# EAGLE design 609_gecko (EAGLE 9.6.2)
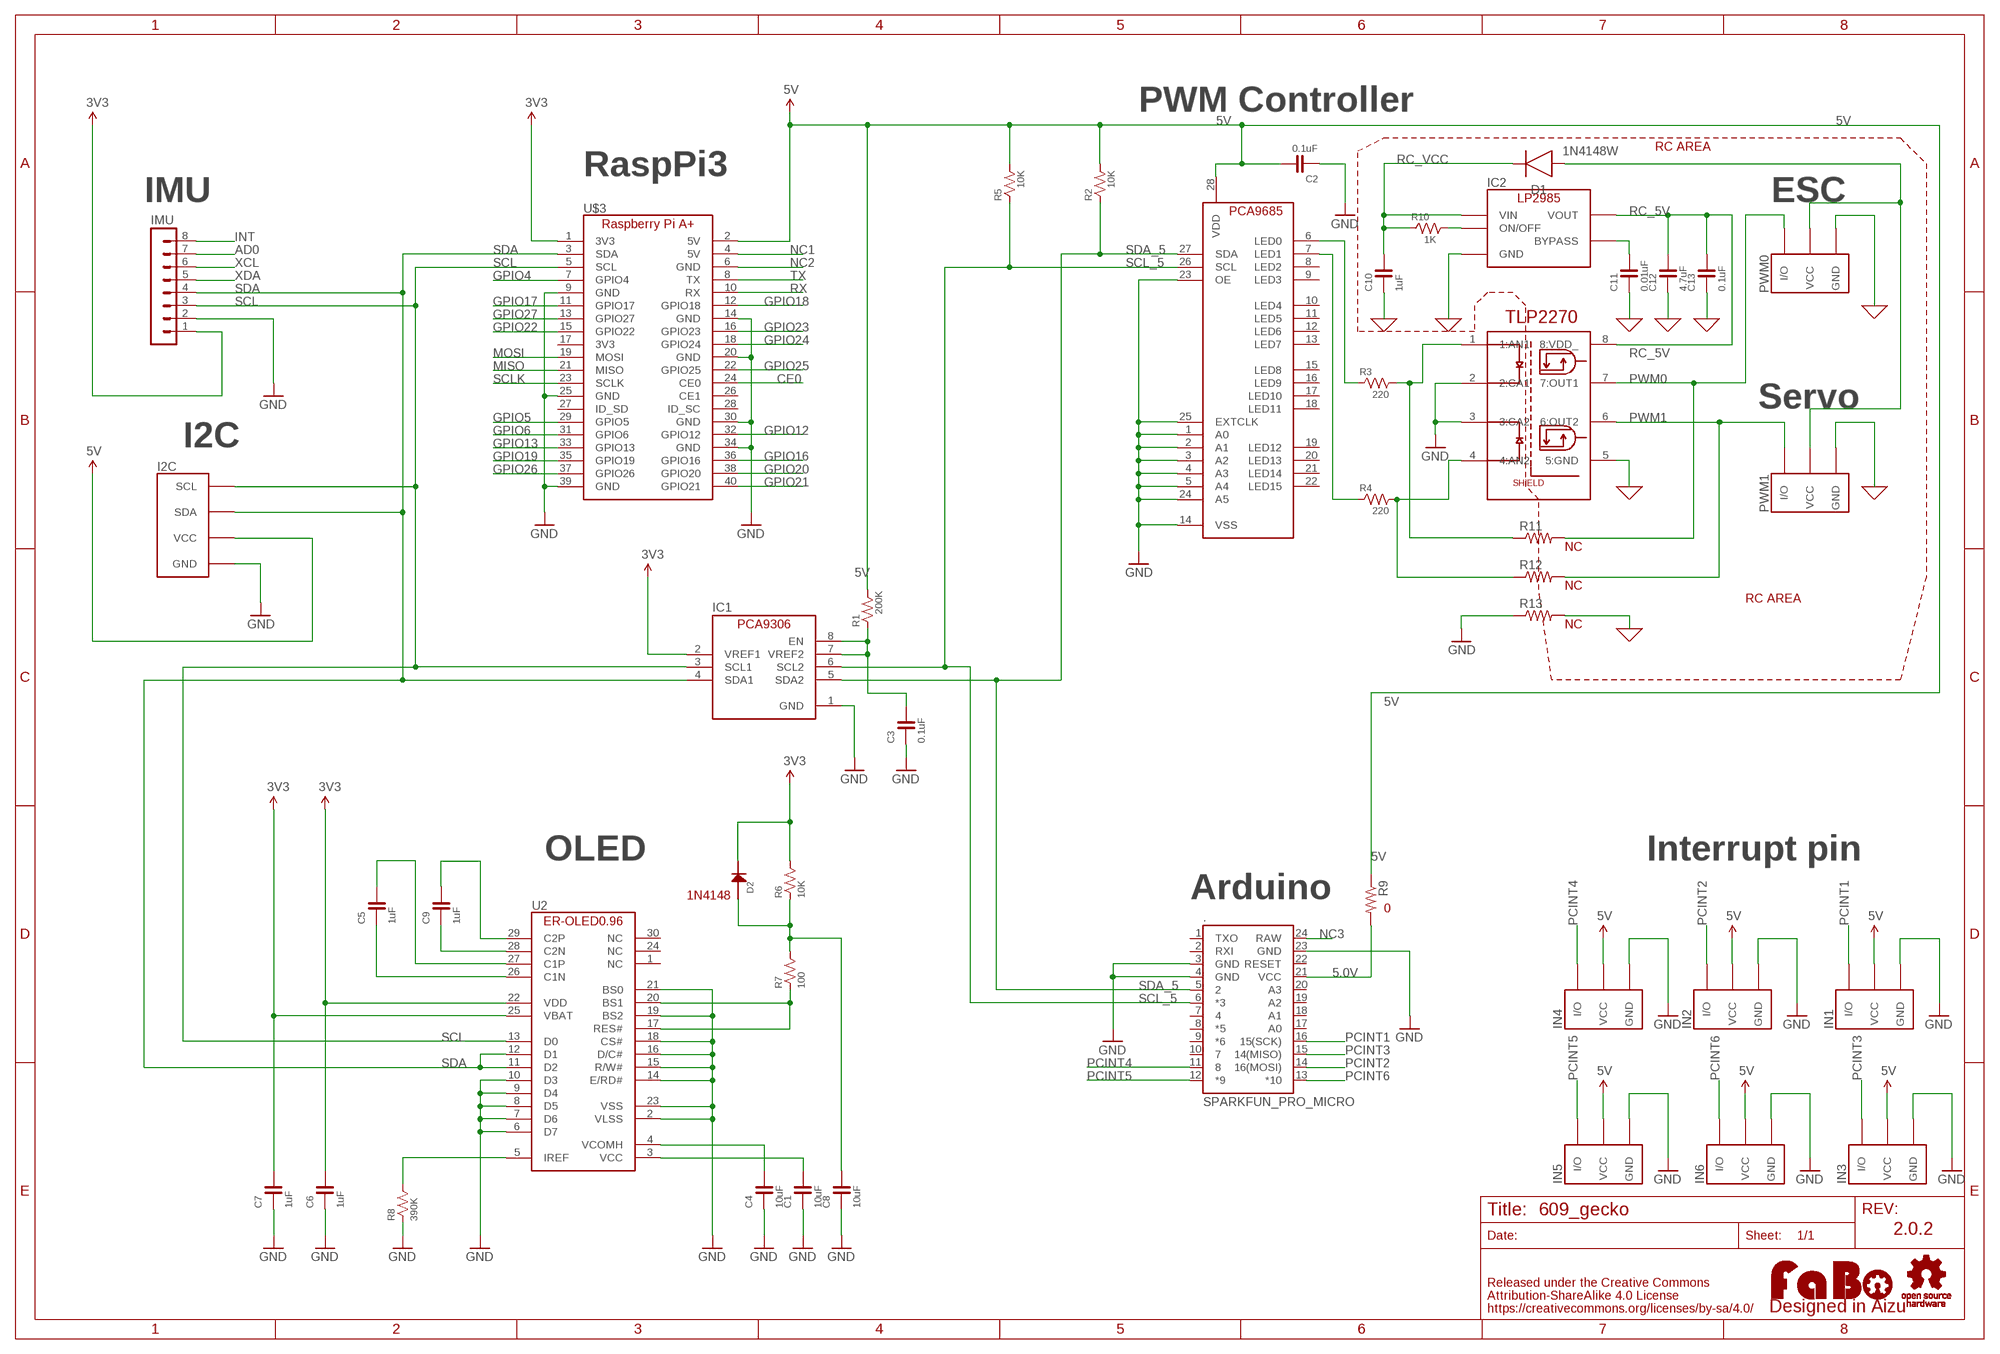
[diagram p0: schematic, sheet 1]

## Parts
.  SPARKFUN_PRO_MICRO  [SPARKFUN_PRO_MICRO]
C1  10uF  CAPACITOR-0603  [0603]
C2  0.1uF  CAPACITOR-0603  [0603]
C3  0.1uF  CAPACITOR-0603  [0603]
C4  10uF  CAPACITOR-0603  [0603]
C5  1uF  CAPACITOR-0603  [0603]
C6  1uF  CAPACITOR-0603  [0603]
C7  1uF  CAPACITOR-0603  [0603]
C8  10uF  CAPACITOR-0603  [0603]
C9  1uF  CAPACITOR-0603  [0603]
C10  1uF  CAPACITOR-0603  [0603]
C11  0.01uF  CAPACITOR-0603  [0603]
C12  4.7uF  CAPACITOR-0603  [0603]
C13  0.1uF  CAPACITOR-0603  [0603]
D1  1N4148W  DIODE_1N4148W-7-F_SOD123G  [SOD3715X135]
D2  1N4148  [1N4148W]
I2C  FABO_BRICK_I2C-B04B-PASK-1_SILK  [FABO_BRICK_I2C_B04B-PASK-1_SILK]
IC1  PCA9306_SSOP  [8PIN-SSOP]
IC2  LP2985-33DBV  [SOT-23-5]
IMU  MA08-1  [MA08-1]
IN1  FABO_BRICK_3PIN-HEADER  [FABO_BRICK_3PIN_HEADER]
IN2  FABO_BRICK_3PIN-HEADER  [FABO_BRICK_3PIN_HEADER]
IN3  FABO_BRICK_3PIN-HEADER  [FABO_BRICK_3PIN_HEADER]
IN4  FABO_BRICK_3PIN-HEADER  [FABO_BRICK_3PIN_HEADER]
IN5  FABO_BRICK_3PIN-HEADER  [FABO_BRICK_3PIN_HEADER]
IN6  FABO_BRICK_3PIN-HEADER  [FABO_BRICK_3PIN_HEADER]
LOGO1  LOGO_FABO-M  [LOGO_FABO_M]
PWM0  FABO_BRICK_3PIN-HEADER  [FABO_BRICK_3PIN_HEADER]
PWM1  FABO_BRICK_3PIN-HEADER  [FABO_BRICK_3PIN_HEADER]
R1  200K  RESISTOR-0603  [0603]
R2  10K  RESISTOR-0603  [0603]
R3  220  RESISTOR-0603  [0603]
R4  220  RESISTOR-0603  [0603]
R5  10K  RESISTOR-0603  [0603]
R6  10K  RESISTOR-0603  [0603]
R7  100  RESISTOR-0603  [0603]
R8  390K  RESISTOR-0603  [0603]
R9  CRCW08050000Z0EA  [RES_0805]
R10  1K  RESISTOR-0603  [0603]
R11  CRCW08050000Z0EA  [RES_0805]
R12  CRCW08050000Z0EA  [RES_0805]
R13  CRCW08050000Z0EA  [RES_0805]
U2  ER-OLED0.96-1ER-CON30HT-1  [ER-CON30HT-1]
U$3  RASPBERRY_PI_A+  [RASPBERRY_PI_A+]
U$9  PCA9685  [PCA9685]
U$10  TLP2270  [TLP2270]
U$12  LOGO_OSHW-M_BOTTOM  [LOGO_OSHW_M_BOTTOM]

## Nets
0: C10.1 C11.1 C12.1 C13.1 IC2.2(GND) PWM0.GND PWM1.GND R13.2 U$10.5(5:GND) ; supply symbol labelled GND
3V3: C6.2 C7.2 D2.CATHODE IC1.2(VREF1) IMU.1 R6.2 U2.22(VDD) U2.25(VBAT) U$3.1(3V3)
5.0V: ..21(VCC) R9.2
5V: C2.2 I2C.VCC IN1.VCC IN2.VCC IN3.VCC IN4.VCC IN5.VCC IN6.VCC R1.2 R2.2 R5.2 R9.1 U$3.2(5V) U$9.28(VDD)
AD0: IMU.7
CE0: U$3.24(CE0)
GND: ..3(GND) ..4(GND) ..23(GND) C1.1 C2.1 C3.1 C4.1 C6.1 C7.1 C8.1 I2C.GND IC1.1(GND) IMU.2 IN1.GND IN2.GND IN3.GND IN4.GND IN5.GND IN6.GND R8.1 R13.1 U2.2(VLSS) U2.6(D7) U2.7(D6) U2.8(D5) U2.9(D4) U2.10(D3) U2.14(E/RD#) U2.15(R/W#) U2.16(D/C#) U2.18(CS#) U2.19(BS2) U2.21(BS0) U2.23(VSS) U$3.9(GND) U$3.14(GND) U$3.20(GND) U$3.25(GND) U$3.30(GND) U$3.34(GND) U$3.39(GND) U$9.1(A0) U$9.2(A1) U$9.3(A2) U$9.4(A3) U$9.5(A4) U$9.14(VSS) U$9.23(OE) U$9.24(A5) U$9.25(EXTCLK) U$10.2(2:CA1) U$10.3(3:CA2)
GPIO4: U$3.7(GPIO4)
GPIO5: U$3.29(GPIO5)
GPIO6: U$3.31(GPIO6)
GPIO12: U$3.32(GPIO12)
GPIO13: U$3.33(GPIO13)
GPIO16: U$3.36(GPIO16)
GPIO17: U$3.11(GPIO17)
GPIO18: U$3.12(GPIO18)
GPIO19: U$3.35(GPIO19)
GPIO20: U$3.38(GPIO20)
GPIO21: U$3.40(GPIO21)
GPIO22: U$3.15(GPIO22)
GPIO23: U$3.16(GPIO23)
GPIO24: U$3.18(GPIO24)
GPIO25: U$3.22(GPIO25)
GPIO26: U$3.37(GPIO26)
GPIO27: U$3.13(GPIO27)
INT: IMU.8
MISO: U$3.21(MISO)
MOSI: U$3.19(MOSI)
N$2: R3.1 U$9.6(LED0)
N$3: C5.2 U2.27(C1P)
N$4: R4.1 U$9.7(LED1)
N$5: C3.2 IC1.7(VREF2) IC1.8(EN) R1.1
N$6: D1.2(A) PWM0.VCC PWM1.VCC
N$7: R3.2 R11.1 U$10.1(1:AN1)
N$8: R4.2 R12.1 U$10.4(4:AN2)
N$13: IC2.3(ON/OFF) R10.2
N$14: C11.2 IC2.4(BYPASS)
N$19: C5.1 U2.26(C1N)
N$21: C9.1 U2.28(C2N)
N$22: C9.2 U2.29(C2P)
N$30: R8.2 U2.5(IREF)
N$31: C4.2 U2.4(VCOMH)
N$33: C1.2 U2.3(VCC)
N$34: R7.1 U2.17(RES#) U2.20(BS1)
N$35: C8.2 D2.ANODE R6.1 R7.2
NC1: U$3.4(5V)
NC2: U$3.6(GND)
NC3: ..24(RAW)
PCINT1: ..16(15(SCK)) IN1.I/O
PCINT2: ..14(16(MOSI)) IN2.I/O
PCINT3: ..15(14(MISO)) IN3.I/O
PCINT4: ..11 IN4.I/O
PCINT5: ..12(*9) IN5.I/O
PCINT6: ..13(*10) IN6.I/O
PWM0: PWM0.I/O R11.2 U$10.7(7:OUT1)
PWM1: PWM1.I/O R12.2 U$10.6(6:OUT2)
RC_5V: C12.2 C13.2 IC2.5(VOUT) U$10.8(8:VDD_)
RC_VCC: C10.2 D1.1(C) IC2.1(VIN) R10.1
RX: U$3.10(RX)
SCL: I2C.SCL IC1.3(SCL1) IMU.3 U2.13(D0) U$3.5(SCL)
SCL_5: ..6(*3) IC1.6(SCL2) R5.1 U$9.26(SCL)
SCLK: U$3.23(SCLK)
SDA: I2C.SDA IC1.4(SDA1) IMU.4 U2.11(D2) U2.12(D1) U$3.3(SDA)
SDA_5: ..5 IC1.5(SDA2) R2.1 U$9.27(SDA)
TX: U$3.8(TX)
XCL: IMU.6
XDA: IMU.5
Unconnected: ..1(TXO) ..2(RXI) ..7 ..8(*5) ..9(*6) ..10 ..17(A0) ..18(A1) ..19(A2) ..20(A3) ..22(RESET) U2.1(NC) U2.24(NC) U2.30(NC) U$3.17(3V3) U$3.26(CE1) U$3.27(ID_SD) U$3.28(ID_SC) U$9.8(LED2) U$9.9(LED3) U$9.10(LED4) U$9.11(LED5) U$9.12(LED6) U$9.13(LED7) U$9.15(LED8) U$9.16(LED9) U$9.17(LED10) U$9.18(LED11) U$9.19(LED12) U$9.20(LED13) U$9.21(LED14) U$9.22(LED15)

## Notes on the sheet
- PWM Controller
- RC AREA
- RaspPi3
- IMU | ESC
- Servo
- I2C
- NC
- NC
- RC AREA
- NC
- Interrupt pin
- OLED
- 1N4148 | Arduino
- 0
- 2.0.2

## Library data of the parts
. = SparkFun-Boards:SPARKFUN_PRO_MICRO: SparkFun Pro Micro Atmega32U4 compatible footprint. SparkFun Products: 3.3V/8MHz <https://www.sparkfun.com/products/12587> 5V/16MHz <https://www.sparkfun.com/products/12640>
C1 C2 C4-C9 = FaBo-Capacitor:CAPACITOR: CAPACITOR
C3 C10-C13 = FaBo-Capacitor:CAPACITOR: CAPACITOR; SPICEPREFIX: C
D1 = Diode:DIODE_: Diode Rectifier - Popular parts; CATEGORY: Diode; DESCRIPTION: DIODE GEN PURP 100V 300MA SOD123; MANUFACTURER: Diodes Incorporated; SUB-CATEGORY: Rectifier
D2 = FaBo-Diode:1N4148
I2C = FaBo-Template:FABO_BRICK_I2C: FaBo Brick I2C
IC1 = FaBo-LevelTranslator:PCA9306
IC2 = FaBo-Supply:LP2985: LP2985
IMU = con-lstb:MA08-1: PIN HEADER; OC_FARNELL: unknown; OC_NEWARK: unknown
IN1-IN6 PWM0 PWM1 = FaBo-Template:FABO_BRICK_3PIN: FaBo Brick 3pin
LOGO1 = component:LOGO_FABO
R1-R8 R10 = FaBo-Resistors:RESISTOR: RESISTOR
R9 R11-R13 = Resistor_Capacitor:CRCW08050000Z0EA: RES SMD 0 OHM JUMPER 1/8W 0805 Manufacturer's datasheet <http://www.vishay.com/docs/20035/dcrcwe3.pdf>; CREATED_BY: PCBLayout.com; DIGIKEY_PART_NUMBER: 541-0.0ATR-ND; MANUFACTURER: Vishay Dale; MPN: CRCW08050000Z0EA; PACKAGE: SMD 0805
U2 = FaBo-Display:ER-OLED0.96-1
U$3 = FaBo-Boards:RASPBERRY_PI_A+
U$9 = FaBo-Motor:PCA9685
U$10 = FaBo_Photocoupler:TLP2270
U$12 = component:LOGO_OSHW

## Board
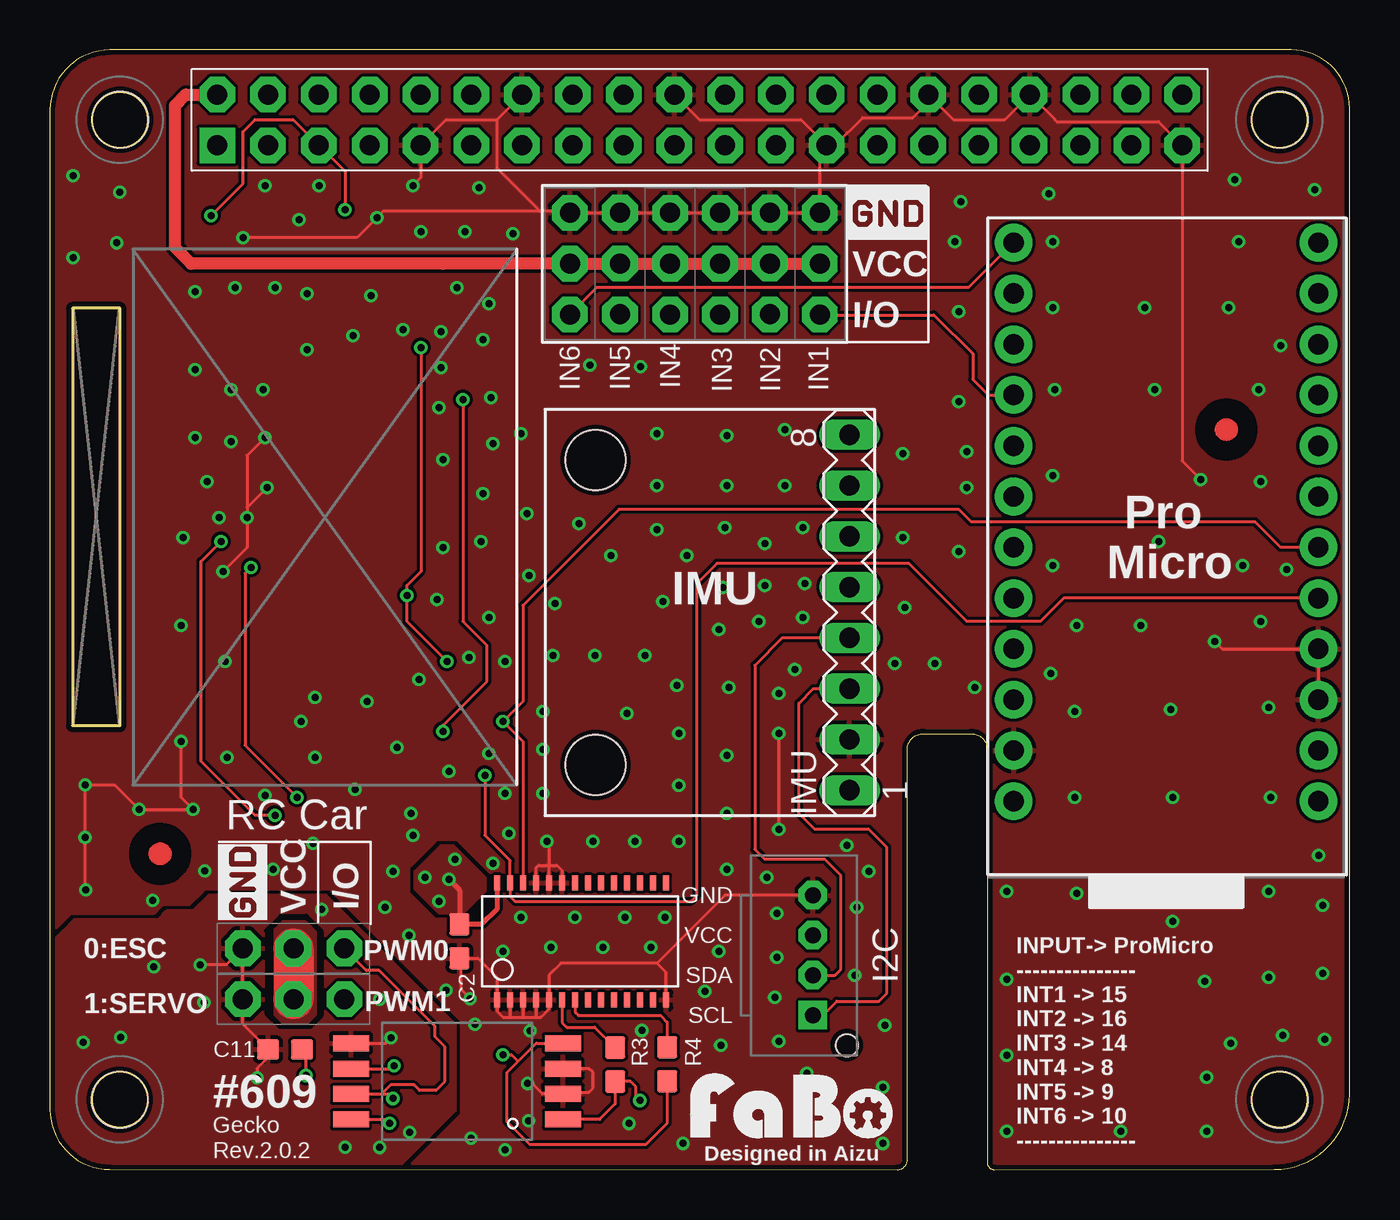
[diagram p1: board, top side]
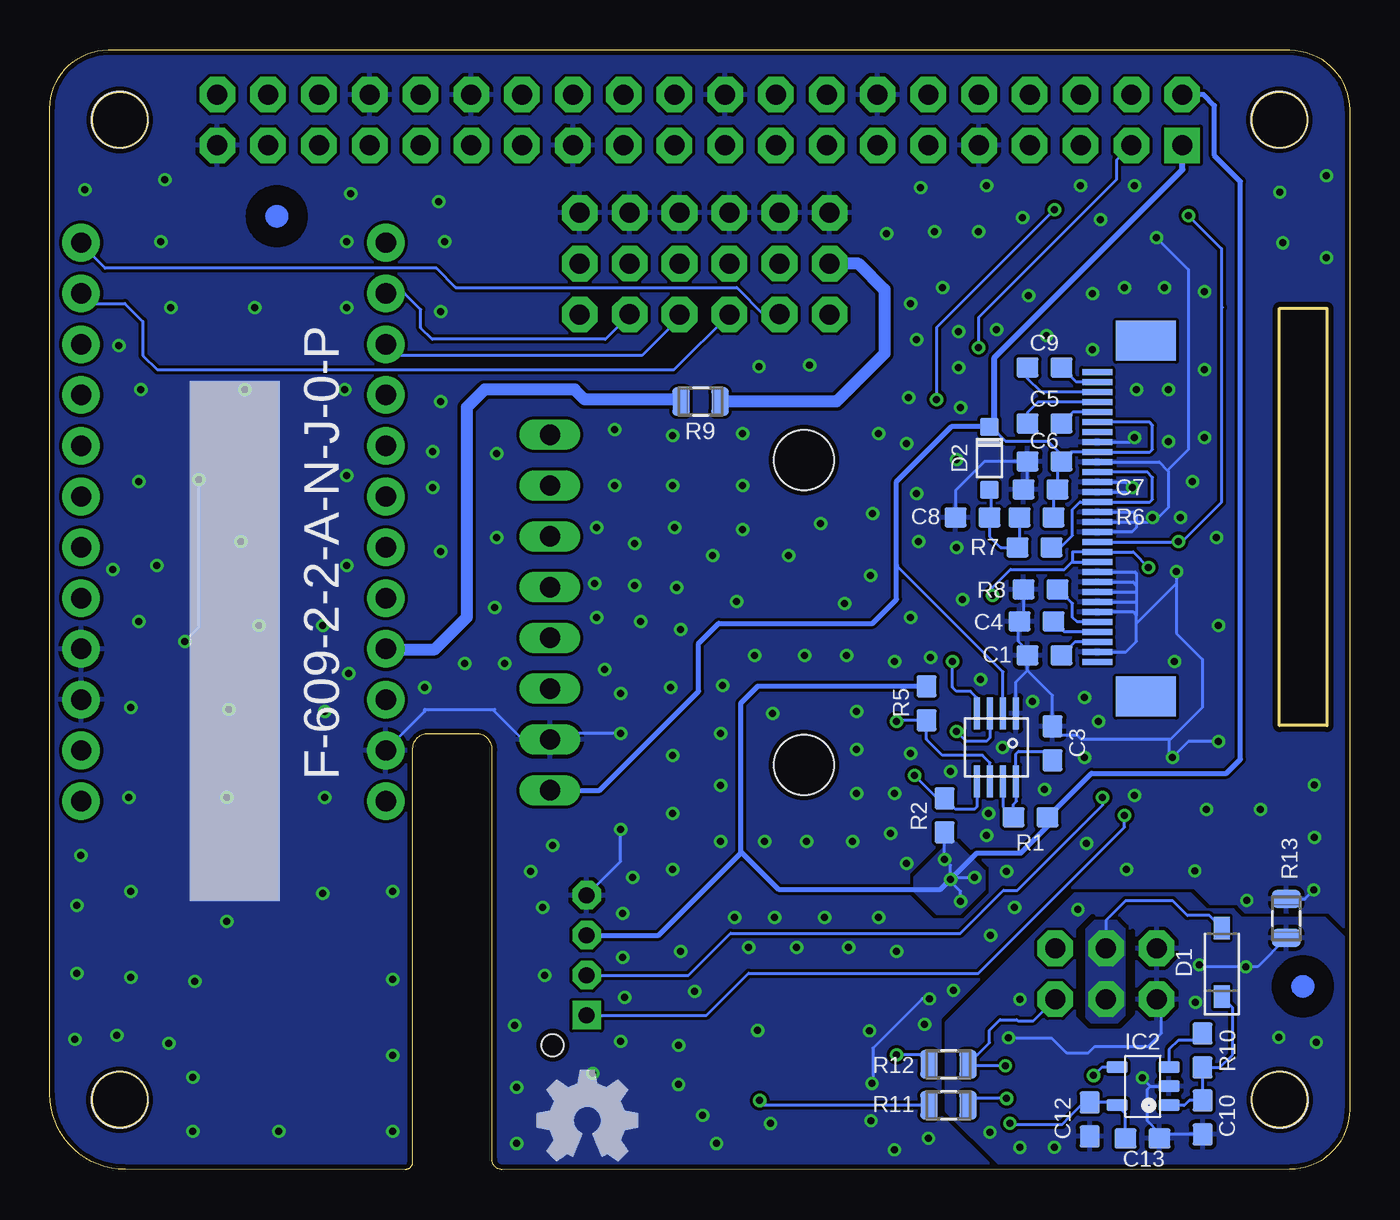
[diagram p2: board, bottom side, seen from below]

Size 65 x 56 mm. Coordinates in mm from the lower left corner, seen from the top.
Outline: 3.5,22.21 3.5,43.09 1.13,43.09 1.13,22.21 3.5,22.21
Copper layers (1*16): Top 0.035mm / dielectric 1.6mm / Bottom 0.035mm
Design rules "PCBway": minimum track width 6mil, minimum drill 12mil, track to track 6mil, track to pad 6mil, pad to pad 6mil, via to via 6mil, smd to smd 6mil, copper to edge 10mil, drill to drill 10mil, minimum pad ring 10mil, minimum via ring 6mil, stop-mask expansion 2mil, vias tented up to drill 100mil, thermal gap 8mil
Holes 2.8 mm at 3.49,3.49 3.51,52.52 61.51,52.51 61.52,3.5
Holes 3 mm at 27.29,35.49 27.29,20.25
tRestrict: 8 lines
bRestrict: 16 lines

### Footprints (pad centres in the part's own frame; a part is rotated, then mirrored left to right if it is on the bottom)
SPARKFUN_PRO_MICRO = drill 1.016 pad 1.88: 1 -7.62,12.7; 2 -7.62,10.16; 3 -7.62,7.62; 4 -7.62,5.08; 5 -7.62,2.54; 6 -7.62,0; 7 -7.62,-2.54; 8 -7.62,-5.08; 9 -7.62,-7.62; 10 -7.62,-10.16; 11 -7.62,-12.7; 12 -7.62,-15.24; 13 7.62,-15.24; 14 7.62,-12.7; 15 7.62,-10.16; 16 7.62,-7.62; 17 7.62,-5.08; 18 7.62,-2.54; 19 7.62,0; 20 7.62,2.54; 21 7.62,5.08; 22 7.62,7.62; 23 7.62,10.16; 24 7.62,12.7
0603 = smd 1.1 x 1: 1 -0.85,0; 2 0.85,0
SOD3715X135 = smd 1.127 x 0.784: 1 -1.722,0; 2 1.722,0
1N4148W = smd 0.9 x 0.95: ANODE 0,0; CATHODE 3.15,0
FABO_BRICK_I2C_B04B-PASK-1_SILK = drill 0.8 pad 1.422 octagon: GND -3,0; SDA 1,0; VCC -1,0 | drill 0.8 pad 1.422 square: SCL 3,0 | hole 1.1: 4.5,1.7
8PIN-SSOP = smd 0.3 x 1.6: 1 -0.975,-1.7; 2 -0.325,-1.7; 3 0.325,-1.7; 4 0.975,-1.7; 5 0.975,1.7; 6 0.325,1.7; 7 -0.325,1.7; 8 -0.975,1.7
SOT-23-5 = smd 0.6 x 1.05: 1 -0.95,-1.3; 2 0,-1.3; 3 0.95,-1.3; 4 0.95,1.3; 5 -0.95,1.3
MA08-1 = drill 1.016 long: 1 -8.89,0; 2 -6.35,0; 3 -3.81,0; 4 -1.27,0; 5 1.27,0; 6 3.81,0; 7 6.35,0; 8 8.89,0
FABO_BRICK_3PIN_HEADER = drill 1 pad 1.778 octagon: GND -2.54,0; I/O 2.54,0; VCC 0,0
RES_0805 = smd 0.87 x 1.42: 1 -0.975,0; 2 0.975,0
ER-CON30HT-1 = smd 0.3 x 1.5 bottom: 1 7,-0.23; 2 6.5,-0.23; 3 6,-0.23; 4 5.5,-0.23; 5 5,-0.23; 6 4.5,-0.23; 7 4,-0.23; 8 3.5,-0.23; 9 3,-0.23; 10 2.5,-0.23; 11 2,-0.23; 12 1.5,-0.23; 13 1,-0.23; 14 0.5,-0.23; 15 0,-0.23; 16 -0.5,-0.23; 17 -1,-0.23; 18 -1.5,-0.23; 19 -2,-0.23; 20 -2.5,-0.23; 21 -3,-0.23; 22 -3.5,-0.23; 23 -4,-0.23; 24 -4.5,-0.23; 25 -5,-0.23; 26 -5.5,-0.23; 27 -6,-0.23; 28 -6.5,-0.23; 29 -7,-0.23; 30 -7.5,-0.23 | smd 2 x 3 bottom: 31 -9.07,-2.67; 32 8.74,-2.67
RASPBERRY_PI_A+ = drill 1 pad 1.778 square: 1 8.484,51.435 | drill 1 pad 1.778 octagon: 2 8.484,53.975; 3 11.024,51.435; 4 11.024,53.975; 5 13.564,51.435; 6 13.564,53.975; 7 16.104,51.435; 8 16.104,53.975; 9 18.644,51.435; 10 18.644,53.975; 11 21.184,51.435; 12 21.184,53.975; 13 23.724,51.435; 14 23.724,53.975; 15 26.264,51.435; 16 26.264,53.975; 17 28.804,51.435; 18 28.804,53.975; 19 31.344,51.435; 20 31.344,53.975; 21 33.884,51.435; 22 33.884,53.975; 23 36.424,51.435; 24 36.424,53.975; 25 38.964,51.435; 26 38.964,53.975; 27 41.504,51.435; 28 41.504,53.975; 29 44.044,51.435; 30 44.044,53.975; 31 46.584,51.435; 32 46.584,53.975; 33 49.124,51.435; 34 49.124,53.975; 35 51.664,51.435; 36 51.664,53.975; 37 54.204,51.435; 38 54.204,53.975; 39 56.744,51.435; 40 56.744,53.975
PCA9685 = smd 0.3 x 0.75: 1 -4.15,-2.93; 2 -3.5,-2.93; 3 -2.85,-2.93; 4 -2.2,-2.93; 5 -1.55,-2.93; 6 -0.9,-2.93; 7 -0.25,-2.93; 8 0.4,-2.93; 9 1.05,-2.93; 10 1.7,-2.93; 11 2.35,-2.93; 12 3,-2.93; 13 3.65,-2.93; 14 4.3,-2.93; 15 4.3,2.92; 16 3.65,2.92; 17 3,2.92; 18 2.35,2.92; 19 1.7,2.92; 20 1.05,2.92; 21 0.4,2.92; 22 -0.25,2.92; 23 -0.9,2.92; 24 -1.55,2.92; 25 -2.2,2.92; 26 -2.85,2.92; 27 -3.5,2.92; 28 -4.15,2.92
TLP2270 = smd 0.8 x 1.8: 1 -1.905,-5.3; 2 -0.635,-5.3; 3 0.635,-5.3; 4 1.905,-5.3; 5 1.905,5.3; 6 0.635,5.3; 7 -0.635,5.3; 8 -1.905,5.3

### Placement (x,y rotation side)
.  55.82,31.13 180 top
C1  15.25,25.73 0 bottom
C2  20.49,11.42 90 top
C3  14.85,21.33 270 bottom
C4  15.65,27.43 0 bottom
C5  15.25,37.33 180 bottom
C6  15.25,35.43 0 bottom
C7  15.45,34.03 0 bottom
C8  18.85,32.63 0 bottom
C9  15.25,40.13 0 bottom
C10  7.34,2.62 90 bottom
C11  11.76,6.02 0 top
C12  12.99,2.51 90 bottom
C13  10.35,1.57 180 bottom
D1  6.39,10.37 90 bottom
D2  18.01,34.01 90 bottom
I2C  38.15,10.73 270 top
IC1  17.65,21.13 180 bottom
IC2  10.33,4.18 90 bottom
IMU  39.99,27.87 90 top
IN1  38.5,45.32 270 top
IN2  36,45.33 270 top
IN3  33.51,45.32 270 top
IN4  31.02,45.32 270 top
IN5  28.51,45.33 270 top
IN6  26,45.32 270 top
LOGO1  37.1,1.2 0 top
PWM0  12.18,11.07 0 top
PWM1  12.18,8.53 0 top
R1  15.95,17.63 0 bottom
R2  20.25,17.73 270 bottom
R3  28.27,5.25 270 top
R4  30.87,5.27 270 top
R5  21.15,23.33 90 bottom
R6  15.65,32.63 0 bottom
R7  15.75,31.13 180 bottom
R8  15.45,29.03 0 bottom
R9  32.45,38.43 180 bottom
R10  7.36,5.97 90 bottom
R11  20.05,3.23 0 bottom
R12  20.05,5.28 0 bottom
R13  3.15,12.57 270 bottom
U2  12.85,32.4 270 top
U$2  [LOGO_SILK_GND]  40,46.57 0 top
U$3  -0.11,-0.2 0 top
U$5  [MARK_POINT_3MM]  5.51,15.8 0 top
U$6  [MARK_POINT_3MM]  58.84,37.02 0 top
U$7  [LOGO_SILK_GND]  10.9,12.46 90 top
U$8  [MARK_POINT_3MM]  53.65,47.69 0 bottom
U$9  26.52,11.41 0 top
U$10  20.36,4.42 90 top
U$11  [MARK_POINT_3MM]  2.33,9.17 0 bottom
U$12  38.11,2.47 0 top

### Tracks (layer width: path | path; a pad name or v marks a point on that pad's centre or on a via)
0  (via drill 0.35)
  Top 0.152: v10.36,4.59 10.36,5.07 10.91,5.62 C11.1 9.64,7.29 PWM1.GND PWM0.GND 8.82,10.25 v7.52,10.25 | U$10.5 16.79,6.32 v17.05,6.59
  Bottom 0.152: C10.1 9.3,1.77 C13.1 9.5,1.83 10.11,2.44 10.11,4.02 9.95,4.18 | v10.36,4.59 9.95,4.18 | 9.95,4.18 IC2.2 | v17.05,6.59 14.9,6.59 14.16,5.85 13.06,5.85 12.74,6.17 10.07,6.17 9.41,6.83 9.41,8.3 PWM1.GND | R13.2 4.6,10.15 v5.18,10.15 7.42,10.15 v7.52,10.25
  other vias: 1.67,6.37 3.54,6.62 17.98,1.87 14.76,1.13 16.48,1.11 16.49,8.53 7.7,8.38 13.59,13.01
  pour Bottom (rank 3): -0.05,11.31 1.21,12.57 5.38,12.57 5.81,13 7.14,13 7.93,13.79 13.76,13.79 20.18,7.37 20.18,2.93 17.51,0.26 -0.01,0.26
  pour Top (rank 3): -0.02,11.27 1.24,12.53 5.41,12.53 5.84,12.96 7.17,12.96 7.96,13.75 13.79,13.75 20.27,7.27 20.27,2.95 17.54,0.22 0.02,0.22
3V3
  Bottom 0.152: IC1.2 17.33,24.9 22.65,30.23 | C6.2 14.4,35.78 15.05,36.43 17.18,36.43 17.91,37.16 D2.CATHODE | C6.2 13.93,35.9 U2.22 9.98,35.9 9.85,36.03 9.85,37.23 10.02,37.4 U2.25 | C6.2 14.6,35.23 C7.2 14.8,33.83 R6.2
  Bottom 0.254: D2.CATHODE 19.92,37.16 22.65,34.43 22.65,30.23 22.65,28.53 23.85,27.33 31.55,27.33 32.55,26.33 32.55,23.93 37.5,18.98 IMU.1
  Bottom 0.305: D2.CATHODE 17.75,37.42 17.75,40.63 8.35,50.03 8.35,51.22 U$3.1
5.0V
  Bottom 0.61: R9.2 33.53,38.53 38.25,38.53 38.75,39.03 43.25,39.03 44.15,38.13 44.15,27.63 45.75,26.03 48.18,26.03 ..21
5V  (via drill 0.35)
  Top 0.152: 20.16,45.32 19.65,45.32
  Top 0.254: U$9.28 22.35,13.03 21.6,12.27 C2.2 20.49,13.99 v19.95,14.53
  Top 0.61: U$3.2 6.8,53.77 6.25,53.23 6.25,46.13 7.06,45.32 19.65,45.32 IN6.VCC IN5.VCC IN4.VCC IN3.VCC IN2.VCC IN1.VCC
  Bottom 0.152: R2.2 v20.25,15.53 19.95,15.23 v19.95,14.53 19.85,14.63 v18.75,14.63 | v19.45,13.43 19.45,13.93 20,14.48
  Bottom 0.254: 30.45,15.93 30.45,23.33 29.6,24.18 R5.2 | 30.45,15.93 30.45,15.83 34.55,11.73 I2C.VCC | 30.45,15.93 28.55,14.03 20.45,14.03 20,14.48 v19.95,14.53 18.65,15.83 16.45,15.83 15.1,17.18 R1.2 12.9,19.83 6.15,19.83 5.45,20.53 5.45,49.43 6.75,50.73 6.75,53.23 7.3,53.77 U$3.2
  Bottom 0.61: IN6.VCC 24.54,45.32 23.25,44.03 23.25,40.83 25.65,38.43 R9.1
  pour Bottom (no thermals): 19.45,12.83 18.25,14.03 18.25,14.93 19.65,16.33 20.05,16.33 21.75,14.63 21.75,13.93 20.65,12.83
  pour Top (no thermals): 19.45,12.83 18.25,14.03 18.25,14.93 19.55,16.23 20.15,16.23 21.75,14.63 21.75,13.93 20.65,12.83
GND  (via drill 0.35)
  Top 0.152: 22.95,7.63 22.65,7.63 22.37,7.91 U$9.1 22.37,9.61 21.41,10.57 20.55,10.57 | 22.95,7.63 23.65,7.63 | 23.65,7.63 24.35,7.63 | 24.35,7.63 24.55,7.63 24.97,8.04 U$9.5 24.97,9.74 25.55,10.33 30.35,10.33 | U$9.4 24.32,7.66 24.35,7.63 | U$9.3 23.67,7.64 23.65,7.63 | U$9.2 23.02,7.69 22.95,7.63 | U$9.25 24.32,15.09 24.45,15.23 24.85,15.23 | 24.85,15.23 24.95,15.23 | 24.95,15.23 25.35,15.23 25.62,14.96 U$9.23 | U$9.24 24.97,15.11 24.85,15.23 | v24.85,16.43 24.95,16.33 24.95,15.23 | 22.36,52.53 U$3.14 | 22.36,52.53 19.82,52.53 U$3.9 18.53,49.61 v18.15,49.23 | 22.36,52.53 22.36,50.08 24.48,47.96 | 24.51,47.93 24.48,47.96 | v10.75,36.63 9.85,35.73 9.85,33.13 | v10.85,34.13 9.85,33.13 | 9.85,33.13 v9.85,32.63 9.85,31.13 v8.65,29.93 | 24.48,47.96 16.68,47.96 v16.35,47.63 15.35,46.63 v9.65,46.63 | C2.1 20.55,10.57 | U$9.14 30.82,9.86 30.35,10.33 | 30.35,10.33 33.75,13.73 I2C.GND | v36.45,17.03 v36.45,21.83 | U$3.20 32.48,52.53 37.56,52.53 U$3.25 | U$3.25 39.26,51.23 40.65,52.63 43.15,52.63 43.93,53.41 U$3.30 45.18,52.53 47.76,52.53 U$3.34 50.25,52.53 50.35,52.43 55.44,52.43 U$3.39 56.63,35.45 v57.55,34.53 | v58.25,26.43 58.63,26.05 ..4 ..3 | 24.48,47.96 25.9,47.96 IN6.GND IN5.GND IN4.GND IN3.GND IN2.GND IN1.GND 38.5,50.89 U$3.25 | U$10.3 26.99,5.05 27.15,4.89 27.15,4.08 26.95,3.88 25.76,3.88 U$10.2 24.64,3.78 24.11,4.31 v23.89,4.31 | v21.02,8.55 20.55,9.02 20.55,10.57 | v1.78,14 1.75,14.03 v1.75,16.63 1.75,19.22 v1.77,19.24 3.24,19.24 v4.45,18.03 v7.15,18.03 6.55,18.63 v6.55,21.43
  Bottom 0.152: R8.1 16.3,27.63 C4.1 16.55,27.38 16.55,26.43 16.1,25.98 C1.1 16.1,24.98 | C8.1 19.7,33.98 18.25,35.43 C6.1 16.1,34.23 C7.1 | IC1.1 16.68,24.4 16.1,24.98 | U2.2 11.18,25.9 10.65,26.43 10.65,27.33 | 10.65,27.33 10.65,27.73 | 10.65,27.73 10.82,27.9 U2.6 | U2.7 10.65,28.4 | 10.65,28.4 10.65,27.73 | U2.8 10.68,28.9 10.65,28.93 | 10.65,28.93 10.65,28.4 | U2.9 10.82,29.4 10.65,29.23 | U2.10 10.72,29.9 10.65,29.83 10.65,29.23 | 10.65,29.23 10.65,28.93 | U2.16 10.82,32.9 10.65,32.73 10.65,32.43 | 10.65,32.43 10.65,32.13 10.88,31.9 U2.14 | U2.15 10.68,32.4 | 10.68,32.4 10.65,32.43 | 10.68,32.4 10.08,32.4 v9.85,32.63 9.55,32.63 9.05,33.13 9.05,34.93 9.1,34.98 | U2.23 10.98,36.4 v10.75,36.63 | U2.18 11.08,33.9 10.9,34.08 | 10.9,34.08 v10.85,34.13 | U2.19 11.22,34.4 10.9,34.08 | U2.21 9.52,35.4 9.1,34.98 | v9.65,46.63 8.05,45.03 8.05,36.03 9.1,34.98 | 16.1,24.98 14.85,23.73 C3.1 14.4,21.73 13.6,21.73 13.4,21.53 9.01,21.53 | 10.65,27.33 8.65,29.33 | v8.65,29.93 8.65,29.33 | 8.65,29.33 8.65,26.83 7.35,25.53 7.35,23.13 8.95,21.53 9.01,21.53 | ..23 46.26,22.91 46.26,23.03 42.75,23.03 42.75,22.93 41.45,21.63 40.1,21.63 IMU.2 39.68,21.83 v36.45,21.83 | I2C.GND 36.45,15.43 v36.45,17.03 | v57.55,34.53 57.55,27.13 v58.25,26.43 | v23.89,4.31 23.84,4.31 23.84,6.08 21.37,8.55 v21.02,8.55 | R13.1 2.24,13.54 v1.78,14 | v6.55,21.43 8.05,21.43 v8.85,20.63 9.01,20.79 9.01,21.53
  other vias: 47.85,1.93 53.55,1.93 57.85,1.93 63.75,6.53 59.05,6.33 63.45,15.73 51.35,13.83 56.15,12.43 47.85,9.53 51.25,22.93 60.95,23.13 51.25,18.63 61.05,18.63 56.05,23.03 56.15,18.63 63.65,13.23 57.85,4.63 61.65,6.73 47.85,13.93 47.85,5.73 57.75,9.43 63.65,9.83 50.15,30.23 61.85,30.03 59.65,30.23 45.45,30.93 42.65,31.63 37.65,32.13 30.35,32.03 25.25,28.33 30.65,28.43 33.45,27.03 37.75,29.33 33.95,24.13 33.85,20.73 33.85,15.03 36.35,12.83 36.35,10.63 36.25,8.63 36.45,6.43 40.25,9.73 40.35,13.13 39.85,16.23 30.05,11.13 27.65,11.13 25.05,11.13 23.55,12.63 26.25,12.63 28.75,12.63 22.65,10.93 25.15,25.73 29.75,25.73 31.45,16.43 33.85,17.83 31.45,21.83 21.45,49.13 18.55,46.93 23.15,46.83 7.85,34.43 9.25,44.13 10.65,39.03 6.65,31.63 6.55,27.23 13.25,23.63 8.75,25.43 17.95,11.73 16.75,13.13 32.75,8.93 33.45,10.93 30.75,12.63 29.25,16.43 27.15,16.43 24.65,22.93 28.85,22.83 51.35,27.23 54.55,27.23 60.55,27.43 55.45,31.43 50.15,34.73 45.85,35.93 42.65,35.83 50.15,43.13 58.95,43.13 59.45,46.43 50.15,46.43 63.25,49.03 49.95,48.83 45.55,48.43 45.25,46.43 45.45,42.93 50.25,39.03 55.25,39.03 30.35,34.23 36.75,34.23 36.75,37.03 30.35,36.83 23.55,36.83 1.15,49.73 1.15,45.63 7.74,14.95 16.05,43.73 17.65,42.03 10.75,49.23 12.45,47.53 12.85,43.83 13.45,49.23 19.55,40.13 19.45,38.13 19.55,41.93 20.35,44.13 21.65,41.53 22.05,38.63 22.15,36.33 21.65,33.83 21.55,31.43 19.35,28.53 23.85,32.83 23.95,29.73 21.95,27.63 18.45,24.53 17.35,21.13 19.95,19.93 21.95,20.83 22.95,16.83 22.15,15.33 22.75,18.83 24.65,21.03 24.65,18.83 7.25,43.93 7.25,40.03 7.25,36.63 8.45,32.63 9.05,36.43 9.05,39.03 12.85,41.03 15.15,41.73 27.25,25.73 12.55,22.43 15.85,23.43 15.25,19.03 18.05,17.83 18.15,16.73 11.25,44.13 20.75,46.93 21.95,43.33 60.55,34.43 60.45,39.03 54.75,43.13 59.25,49.53 33.55,6.23 41.75,7.23 40.95,14.93 44.25,25.33 42.75,28.13 42.25,25.33 37.25,25.03 33.65,29.13 33.75,32.13 28.05,30.73 26.45,32.33 60.95,13.93 33.57,4.26 41.65,1.31 41.65,4.13 37.85,4.83 19.81,8.97 31.85,30.73 35.75,31.33 37.65,27.63 35.45,27.43 35.75,29.23 36.45,23.83 5.13,13.47 35.85,14.63 33.85,34.23 33.85,36.73 45.45,38.43 45.85,34.13 46.25,24.13 50.05,24.83 19.65,35.53 19.65,31.13 20.95,25.63 22.75,25.43 17.15,14.93 13.25,20.63 31.45,19.23 31.35,24.23 11.15,15.03 10.75,18.73 13.15,16.33 61.55,41.23 60.95,9.63 27,40.24 29.53,40.18 28.96,2.31 31.66,1.31 32.35,2.73 29.6,6.96 23.94,2.44 21.07,1.58 22.76,0.99 21.25,7.27 24.01,6.95 3.49,48.89 3.34,46.36
  pour Top (rank 6): -0.75,-0.07 65.29,-0.07 65.29,56.44 -0.75,56.44
  pour Bottom (rank 6): -0.75,-0.07 65.29,-0.07 65.29,56.44 -0.75,56.44
N$2
  Top 0.152: 28.02,6.1 R3.1 27.25,7.13 25.84,7.13 25.62,7.35 U$9.6
N$3
  Bottom 0.152: 12.12,38.4 U2.27 15.58,38.4 16.1,37.88 C5.2
N$4
  Top 0.152: R4.1 30.83,6.16 30.87,6.21 30.87,7.38 30.54,7.71 26.43,7.71 26.27,7.87 U$9.7
N$5
  Bottom 0.152: C3.2 15.3,20.93 16.55,20.93 16.68,20.8 IC1.8 16.65,19.4 16.65,18.43 16.8,18.28 R1.1 17.33,18.15 IC1.7
N$6
  Top 2: PWM0.VCC PWM1.VCC
  Bottom 0.152: PWM0.VCC 12.18,12.47 11.2,13.45 8.84,13.45 8.1,12.71 7.01,12.71 D1.2
  pour Top (no thermals): 11.65,12.43 12.75,12.43 13.25,11.93 13.25,7.73 12.85,7.33 11.65,7.33 11.25,7.73 11.25,12.03
  pour Bottom (no thermals): 11.65,12.43 12.75,12.43 13.15,12.03 13.15,7.63 12.85,7.33 11.65,7.33 11.25,7.73 11.25,12.03
N$7  (via drill 0.35)
  Top 0.152: U$10.1 27.5,2.51 28.27,3.29 R3.2 29.03,4.4 29.3,4.14 29.3,3.66 v29.5,3.46
  Bottom 0.152: R11.1 29.27,3.23 v29.5,3.46
N$8  (via drill 0.35)
  Top 0.152: R4.2 30.87,2.32 29.79,1.25 24.01,1.25 22.87,2.39 22.87,4.88 23.41,5.42 | U$10.4 24.32,6.32 23.41,5.42 | v22.65,5.75 23.08,5.75 23.41,5.42
  Bottom 0.152: R12.1 21.5,5.75 v22.65,5.75
N$13
  Bottom 0.152: R10.2 7.7,6.48 8.56,6.48 9.03,6.01 IC2.3
N$14  (via drill 0.35)
  Top 0.152: v12.8,4.71 12.8,5.83 C11.2
  Bottom 0.152: IC2.4 12.38,5.13 v12.8,4.71
N$19
  Bottom 0.152: U2.26 13.27,37.9 | U2.26 12.65,37.93 | U2.26 13.83,37.9 C5.1
N$21
  Bottom 0.152: U2.28 15.42,38.9 16.1,39.58 C9.1
N$22
  Bottom 0.152: U2.29 13.67,39.4 C9.2
N$30
  Bottom 0.152: U2.5 13.62,27.4 13.85,27.63 13.85,28.33 14.55,29.03 R8.2
N$31
  Bottom 0.152: 12.77,26.9 U2.4 14.27,26.9 C4.2
N$33
  Bottom 0.152: U2.3 13.73,26.4 C1.2
N$34
  Bottom 0.152: 11.98,33.4 U2.17 | R7.1 14.45,31.13 13.85,31.73 13.85,33.03 13.48,33.4 U2.17 | U2.17 9.98,33.4 9.85,33.53 9.85,34.63 10.12,34.9 U2.20
N$35
  Bottom 0.152: 17.93,32.7 C8.2 18,31.68 17.45,31.13 R7.2 16.5,31.23 R6.1 | 17.93,32.7 17.91,32.72 | D2.ANODE 17.93,33.92 17.93,32.7
PCINT1
  Top 0.152: 38.48,42.75 44.21,42.75 46.15,40.81 46.15,39.53 46.93,38.75 ..16 | IN1.I/O 38.48,42.75 | 38.48,42.75 38.47,42.75
PCINT2
  Bottom 0.152: IN2.I/O 36,42.74 37.21,41.53 45.89,41.53 46.45,42.1 46.45,43.03 47.25,43.83 ..14
PCINT3
  Bottom 0.152: IN3.I/O 33.51,42.6 35.38,40.73 47.64,40.73 ..15
PCINT4
  Bottom 0.152: IN4.I/O 33.79,40.01 59.63,40.01 60.35,40.73 60.35,42.43 61.25,43.33 62.94,43.33 ..11 | IN4.I/O | IN4.I/O
PCINT5
  Bottom 0.152: ..12 63.44,46.29 62.25,45.09 45.67,45.09 44.7,44.12 30.65,44.12 29.33,42.8 28.51,42.8 IN5.I/O
PCINT6
  Top 0.152: IN6.I/O 27.35,44.12 45.95,44.12 ..13 | ..13
PWM0  (via drill 0.35)
  Top 0.152: U$10.7 16.59,3.78 | 16.59,3.78 16.93,3.78 v17.15,3.56 | 16.59,3.78 17.05,4.24 18.21,4.24 18.48,3.97 19.3,3.97 19.76,4.43 19.76,6.14 19.25,6.65 19.25,7.18 16.46,9.97 15.82,9.97 PWM0.I/O
  Bottom 0.152: v17.15,3.56 18.75,3.56 R11.2
PWM1  (via drill 0.35)
  Top 0.152: U$10.6 17.07,5.05 v17.21,5.2
  Bottom 0.152: v17.21,5.2 19,5.2 R12.2 | 19.08,5.94 R12.2 | R12.2 18,6.35 18,6.98 17.48,7.5 16.64,7.5 16.59,7.45 15.8,7.45 PWM1.I/O
RC_5V  (via drill 0.35)
  Top 0.152: U$10.8 16.79,2.51 v16.98,2.32
  Bottom 0.152: C13.2 11.2,2.8 IC2.5 11.76,3.36 C12.2 13.08,3.36 13.29,3.36 13.98,2.67 13.98,2.66 14.37,2.27 16.93,2.27 v16.98,2.32
RC_VCC
  Bottom 0.152: R10.1 7.36,5.09 | 7.36,5.09 7.36,3.49 C10.2 8.01,3.47 8.27,3.21 9.01,3.21 IC2.1 | 7.36,5.09 6.5,5.09 5.84,5.75 5.84,8.09 D1.1
SCL  (via drill 0.35)
  Top 0.152: v11.25,17.73 10.25,17.73 7.55,20.43 7.55,30.43 v8.55,31.43 | I2C.SCL 38.65,7.73 39.35,8.43 41.45,8.43 41.85,8.83 41.85,16.13 40.95,17.03 38.25,17.03 37.45,17.83 37.45,23.33 38.18,24.06 IMU.3 | v8.05,47.73 9.65,49.33 9.65,51.93 10.25,52.53 12.16,52.53 U$3.5 14.75,49.93 v14.75,48.03 | v20.65,38.53 20.65,27.43 21.85,26.23 21.85,24.43 19.65,22.23 v19.65,21.93
  Bottom 0.152: 6.35,43.13 6.4,43.18 | v8.05,47.73 6.4,46.08 6.4,43.18 | 6.4,43.18 6.4,33.38 8.35,31.43 v8.55,31.43 8.58,31.4 U2.13 | I2C.SCL 32.15,7.73 30.05,9.83 18.55,9.83 11.25,17.13 v11.25,17.73 | v14.75,48.03 20.65,42.13 v20.65,38.53 | IC1.3 17.98,21.6 18.15,21.43 19.15,21.43 v19.65,21.93
SCL_5  (via drill 0.35)
  Top 0.152: U$9.26 23.67,21.41 v22.65,22.43 23.65,23.43 23.65,28.23 28.45,33.03 45.45,33.03 46.08,32.39 60.29,32.39 61.55,31.13 ..6
  Bottom 0.152: v22.65,22.43 22.6,22.48 R5.1 21.15,21.53 20.35,20.73 18.35,20.73 17.98,20.35 IC1.6
SDA  (via drill 0.35)
  Top 0.152: v19.85,25.43 17.85,27.43 v17.85,28.73 17.85,29.23 18.55,29.93 v18.55,41.13 | I2C.SDA 39.25,9.73 39.55,10.03 39.55,14.73 38.75,15.53 35.75,15.53 35.25,16.03 35.25,25.23 36.62,26.6 IMU.4 | v10.05,30.13 9.75,29.83 9.75,21.23 v12.35,18.63
  Bottom 0.152: v17.85,28.73 17.85,29.13 16.95,30.03 14.25,30.03 13.88,30.4 13.85,30.4 | U2.12 12.18,30.9 12.25,30.83 | v18.55,41.13 18.55,42.63 11.65,49.53 11.65,50.49 U$3.3 | 13.85,30.4 U2.11 | U2.12 13.85,30.9 13.85,30.4 | IC1.4 18.63,23.6 18.95,23.93 19.65,23.93 19.85,24.13 v19.85,25.43 | I2C.SDA 33.05,9.73 30.95,11.83 19.45,11.83 17.31,13.97 16.6,13.97 12.35,18.22 v12.35,18.63 | U2.12 10.82,30.9 v10.05,30.13
SDA_5  (via drill 0.35)
  Top 0.152: v21.75,19.73 21.75,16.73 23.02,15.46 U$9.27 23.02,13.66 23.25,13.43 32.05,13.43 32.35,13.73 32.35,29.33 33.35,30.33 42.95,30.33 45.86,27.42 49.54,27.42 50.71,28.59 ..5
  Bottom 0.152: v21.75,19.73 20.6,18.58 R2.1 19.7,18.03 18.75,18.03 18.63,18.15 IC1.5

### Text on the board
tPlace: VCC | I/O | Pro / Micro | IMU | RC Car | VCC | I/O | 0:ESC | PWM0 | 1:SERVO | PWM1 | #609 | Gecko | Rev.2.0.2 | Designed in Aizu | INPUT-> ProMicro / --------------- / INT1 -> 15 / INT2 -> 16 / INT3 -> 14 / INT4 -> 8 / INT5 -> 9 / INT6 -> 10 / ---------------
bPlace: F-609-2-2-A-N-J-0-P